# EAGLE design RF test board (EAGLE 7.3.0)
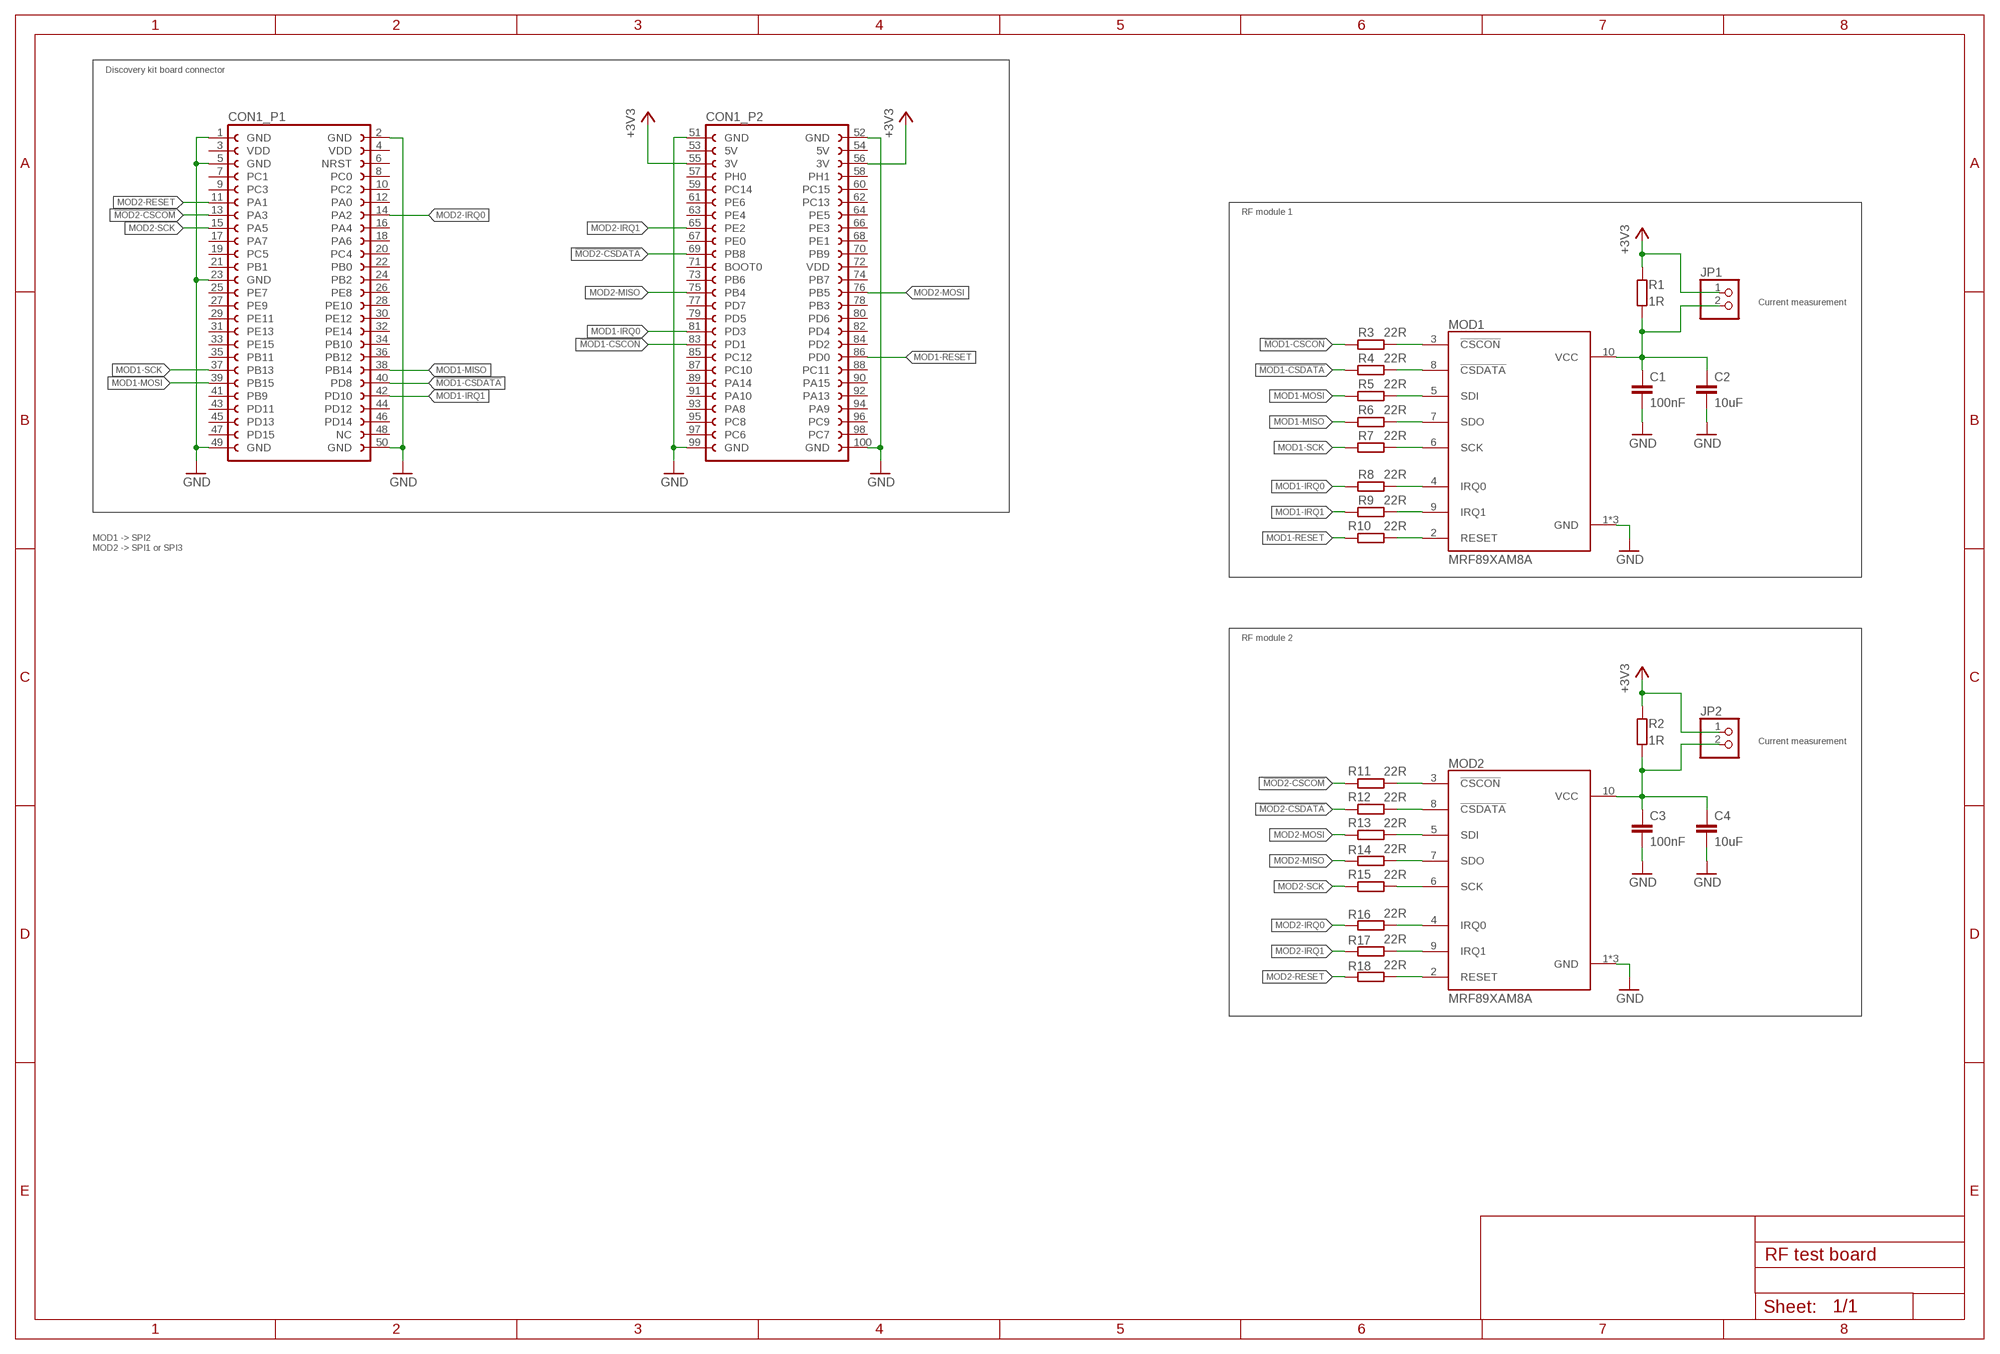
[diagram p0: schematic, sheet 1]

## Parts
C1  100nF  C-EUC0603K  [C0603K]
C2  10uF  C-EUC1206K  [C1206K]
C3  100nF  C-EUC0603K  [C0603K]
C4  10uF  C-EUC1206K  [C1206K]
CON1  STM32F4DISCOVERY-CONNECTOR  [STM32F4DISCOVERY_CONNECTOR]
JP1  PINHD-1X2  [1X02]
JP2  PINHD-1X2  [1X02]
MOD1  MRF89XAM8A  [MRF89XAM8A]
MOD2  MRF89XAM8A  [MRF89XAM8A]
R1  1R  R-EU_R0603  [R0603]
R2  1R  R-EU_R0603  [R0603]
R3  22R  R-EU_R0603  [R0603]
R4  22R  R-EU_R0603  [R0603]
R5  22R  R-EU_R0603  [R0603]
R6  22R  R-EU_R0603  [R0603]
R7  22R  R-EU_R0603  [R0603]
R8  22R  R-EU_R0603  [R0603]
R9  22R  R-EU_R0603  [R0603]
R10  22R  R-EU_R0603  [R0603]
R11  22R  R-EU_R0603  [R0603]
R12  22R  R-EU_R0603  [R0603]
R13  22R  R-EU_R0603  [R0603]
R14  22R  R-EU_R0603  [R0603]
R15  22R  R-EU_R0603  [R0603]
R16  22R  R-EU_R0603  [R0603]
R17  22R  R-EU_R0603  [R0603]
R18  22R  R-EU_R0603  [R0603]

## Nets
!MOD1-CSCON: CON1.83(_P2:PD1) R3.2
!MOD1-CSDATA: CON1.40(_P1:PD8) R4.2
!MOD2-CSCOM: CON1.13(_P1:PA3) R11.2
!MOD2-CSDATA: CON1.69(_P2:PB8) R12.2
+3V3: CON1.55(_P2:3V) CON1.56(_P2:3V) JP1.1 JP2.1 R1.2 R2.2
GND: C1.2 C2.2 C3.2 C4.2 CON1.1(_P1:GND) CON1.2(_P1:GND) CON1.5(_P1:GND) CON1.23(_P1:GND) CON1.49(_P1:GND) CON1.50(_P1:GND) CON1.51(_P2:GND) CON1.52(_P2:GND) CON1.99(_P2:GND) CON1.100(_P2:GND) MOD1.1(GND) MOD1.11(GND) MOD1.12(GND) MOD2.1(GND) MOD2.11(GND) MOD2.12(GND)
MOD1-IRQ0: CON1.81(_P2:PD3) R8.2
MOD1-IRQ1: CON1.42(_P1:PD10) R9.2
MOD1-MISO: CON1.38(_P1:PB14) R6.2
MOD1-MOSI: CON1.39(_P1:PB15) R5.2
MOD1-RESET: CON1.86(_P2:PD0) R10.2
MOD1-SCK: CON1.37(_P1:PB13) R7.2
MOD2-IRQ0: CON1.14(_P1:PA2) R16.2
MOD2-IRQ1: CON1.65(_P2:PE2) R17.2
MOD2-MISO: CON1.75(_P2:PB4) R14.2
MOD2-MOSI: CON1.76(_P2:PB5) R13.2
MOD2-RESET: CON1.11(_P1:PA1) R18.2
MOD2-SCK: CON1.15(_P1:PA5) R15.2
N$1: C1.1 C2.1 JP1.2 MOD1.10(VCC) R1.1
N$2: C3.1 C4.1 JP2.2 MOD2.10(VCC) R2.1
N$3: MOD1.3(!CSCON) R3.1
N$4: MOD1.8(!CSDATA) R4.1
N$5: MOD1.5(SDI) R5.1
N$6: MOD1.7(SDO) R6.1
N$7: MOD1.6(SCK) R7.1
N$8: MOD1.4(IRQ0) R8.1
N$9: MOD1.9(IRQ1) R9.1
N$10: MOD1.2(RESET) R10.1
N$11: MOD2.3(!CSCON) R11.1
N$12: MOD2.8(!CSDATA) R12.1
N$13: MOD2.5(SDI) R13.1
N$14: MOD2.7(SDO) R14.1
N$15: MOD2.6(SCK) R15.1
N$16: MOD2.4(IRQ0) R16.1
N$17: MOD2.9(IRQ1) R17.1
N$18: MOD2.2(RESET) R18.1
Unconnected: CON1.3(_P1:VDD) CON1.4(_P1:VDD) CON1.6(_P1:NRST) CON1.7(_P1:PC1) CON1.8(_P1:PC0) CON1.9(_P1:PC3) CON1.10(_P1:PC2) CON1.12(_P1:PA0) CON1.16(_P1:PA4) CON1.17(_P1:PA7) CON1.18(_P1:PA6) CON1.19(_P1:PC5) CON1.20(_P1:PC4) CON1.21(_P1:PB1) CON1.22(_P1:PB0) CON1.24(_P1:PB2) CON1.25(_P1:PE7) CON1.26(_P1:PE8) CON1.27(_P1:PE9) CON1.28(_P1:PE10) CON1.29(_P1:PE11) CON1.30(_P1:PE12) CON1.31(_P1:PE13) CON1.32(_P1:PE14) CON1.33(_P1:PE15) CON1.34(_P1:PB10) CON1.35(_P1:PB11) CON1.36(_P1:PB12) CON1.41(_P1:PB9) CON1.43(_P1:PD11) CON1.44(_P1:PD12) CON1.45(_P1:PD13) CON1.46(_P1:PD14) CON1.47(_P1:PD15) CON1.48(_P1:NC) CON1.53(_P2:5V) CON1.54(_P2:5V) CON1.57(_P2:PH0) CON1.58(_P2:PH1) CON1.59(_P2:PC14) CON1.60(_P2:PC15) CON1.61(_P2:PE6) CON1.62(_P2:PC13) CON1.63(_P2:PE4) CON1.64(_P2:PE5) CON1.66(_P2:PE3) CON1.67(_P2:PE0) CON1.68(_P2:PE1) CON1.70(_P2:PB9) CON1.71(_P2:BOOT0) CON1.72(_P2:VDD) CON1.73(_P2:PB6) CON1.74(_P2:PB7) CON1.77(_P2:PD7) CON1.78(_P2:PB3) CON1.79(_P2:PD5) CON1.80(_P2:PD6) CON1.82(_P2:PD4) CON1.84(_P2:PD2) CON1.85(_P2:PC12) CON1.87(_P2:PC10) CON1.88(_P2:PC11) CON1.89(_P2:PA14) CON1.90(_P2:PA15) CON1.91(_P2:PA10) CON1.92(_P2:PA13) CON1.93(_P2:PA8) CON1.94(_P2:PA9) CON1.95(_P2:PC8) CON1.96(_P2:PC9) CON1.97(_P2:PC6) CON1.98(_P2:PC7)

## Notes on the sheet
- Discovery kit board connector
- RF module 1
- Current measurement
- MOD1 -> SPI2
  MOD2 -> SPI1 or SPI3
- RF module 2
- Current measurement

## Library data of the parts
C1-C4 = rcl:C-EU: CAPACITOR, European symbol
CON1 = stm32f4Discovery_connector:STM32F4DISCOVERY-CONNECTOR
JP1 JP2 = pinhead:PINHD-1X2: PIN HEADER
MOD1 MOD2 = MRF89XAM8A:MRF89XAM8A
R1-R18 = rcl:R-EU_: RESISTOR, European symbol

## Board
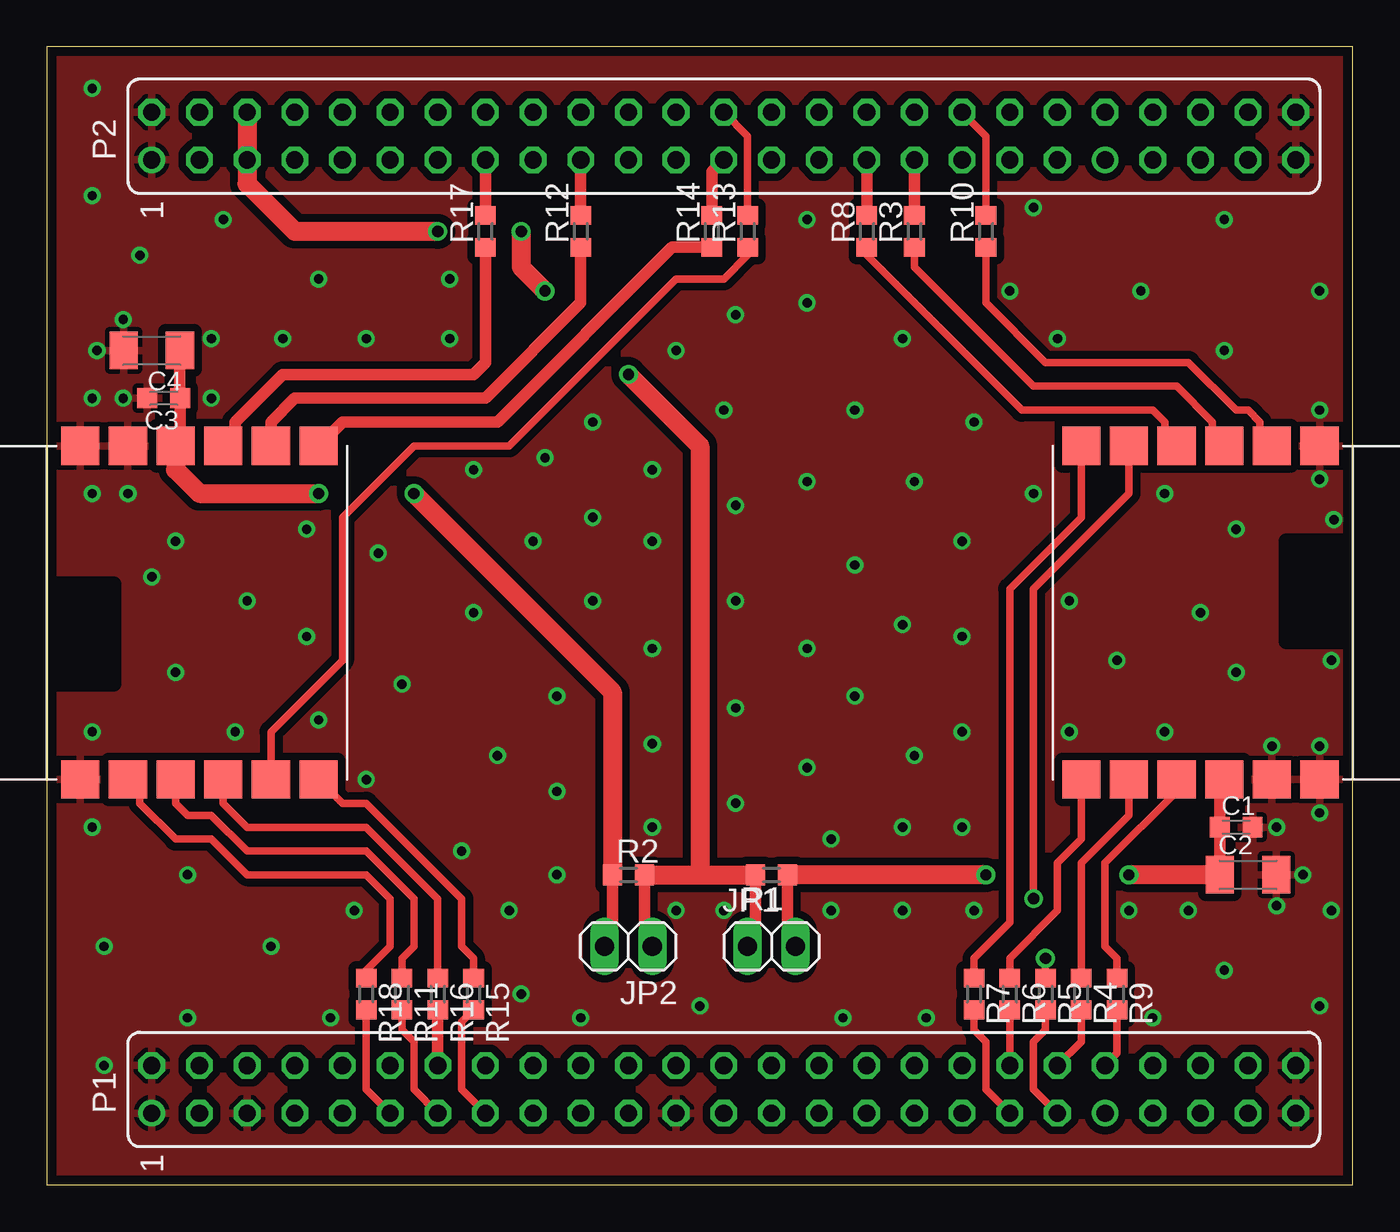
[diagram p1: board, top side]
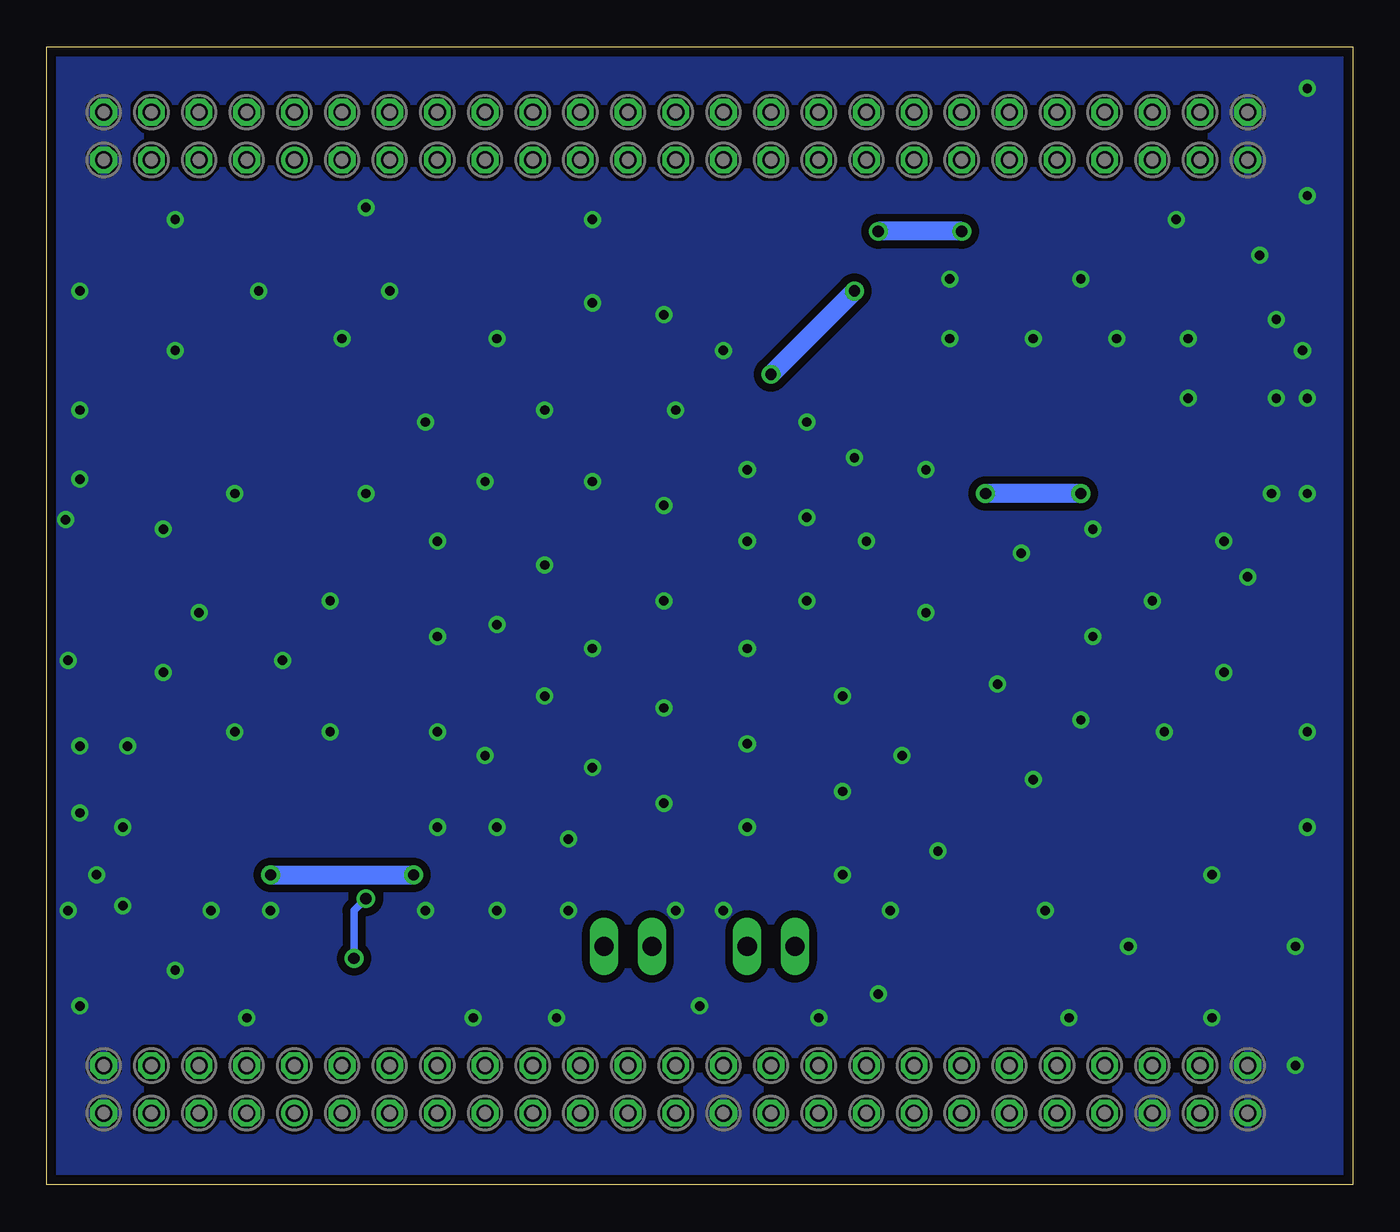
[diagram p2: board, bottom side, seen from below]

Size 69.58 x 60.63 mm. Coordinates in mm from the lower left corner, seen from the top.
Outline: 0,0 69.58,0 69.58,60.63 0,60.63 0,0
Copper layers (1*16): Top 0.035mm / dielectric 1.5mm / Bottom 0.035mm
Design rules "default *": minimum track width 10mil, minimum drill 15mil, track to track 8mil, track to pad 8mil, pad to pad 8mil, via to via 8mil, smd to smd 8mil, copper to edge 20mil, drill to drill 8mil, minimum pad ring 10mil, minimum via ring 8mil, stop-mask expansion 4mil, vias tented up to drill 0mil, thermal gap 10mil

### Footprints (pad centres in the part's own frame; a part is rotated, then mirrored left to right if it is on the bottom)
C0603K = smd 1.05 x 1.08: 1 -0.875,0; 2 0.875,0
C1206K = smd 1.5 x 2: 1 -1.5,0; 2 1.5,0
STM32F4DISCOVERY_CONNECTOR = drill 0.914: 1 -1.27,30.48; 41 -1.27,-20.32; 51 49.53,30.48; 91 49.53,-20.32 | drill 0.914 octagon: 2 1.27,30.48; 3 -1.27,27.94; 4 1.27,27.94; 5 -1.27,25.4; 6 1.27,25.4; 7 -1.27,22.86; 8 1.27,22.86; 9 -1.27,20.32; 10 1.27,20.32; 11 -1.27,17.78; 12 1.27,17.78; 13 -1.27,15.24; 14 1.27,15.24; 15 -1.27,12.7; 16 1.27,12.7; 17 -1.27,10.16; 18 1.27,10.16; 19 -1.27,7.62; 20 1.27,7.62; 21 -1.27,5.08; 22 1.27,5.08; 23 -1.27,2.54; 24 1.27,2.54; 25 -1.27,0; 26 1.27,0; 27 -1.27,-2.54; 28 1.27,-2.54; 29 -1.27,-5.08; 30 1.27,-5.08; 31 -1.27,-7.62; 32 1.27,-7.62; 33 -1.27,-10.16; 34 1.27,-10.16; 35 -1.27,-12.7; 36 1.27,-12.7; 37 -1.27,-15.24; 38 1.27,-15.24; 39 -1.27,-17.78; 40 1.27,-17.78; 42 1.27,-20.32; 43 -1.27,-22.86; 44 1.27,-22.86; 45 -1.27,-25.4; 46 1.27,-25.4; 47 -1.27,-27.94; 48 1.27,-27.94; 49 -1.27,-30.48; 50 1.27,-30.48; 52 52.07,30.48; 53 49.53,27.94; 54 52.07,27.94; 55 49.53,25.4; 56 52.07,25.4; 57 49.53,22.86; 58 52.07,22.86; 59 49.53,20.32; 60 52.07,20.32; 61 49.53,17.78; 62 52.07,17.78; 63 49.53,15.24; 64 52.07,15.24; 65 49.53,12.7; 66 52.07,12.7; 67 49.53,10.16; 68 52.07,10.16; 69 49.53,7.62; 70 52.07,7.62; 71 49.53,5.08; 72 52.07,5.08; 73 49.53,2.54; 74 52.07,2.54; 75 49.53,0; 76 52.07,0; 77 49.53,-2.54; 78 52.07,-2.54; 79 49.53,-5.08; 80 52.07,-5.08; 81 49.53,-7.62; 82 52.07,-7.62; 83 49.53,-10.16; 84 52.07,-10.16; 85 49.53,-12.7; 86 52.07,-12.7; 87 49.53,-15.24; 88 52.07,-15.24; 89 49.53,-17.78; 90 52.07,-17.78; 92 52.07,-20.32; 93 49.53,-22.86; 94 52.07,-22.86; 95 49.53,-25.4; 96 52.07,-25.4; 97 49.53,-27.94; 98 52.07,-27.94; 99 49.53,-30.48; 100 52.07,-30.48
1X02 = drill 1.016 long: 1 -1.27,0; 2 1.27,0
MRF89XAM8A = smd 2.032 x 2.032: 1 -8.89,6.35; 2 -8.89,3.81; 3 -8.89,1.27; 4 -8.89,-1.27; 5 -8.89,-3.81; 6 -8.89,-6.35; 7 8.89,-6.35; 8 8.89,-3.81; 9 8.89,-1.27; 10 8.89,1.27; 11 8.89,3.81; 12 8.89,6.35
R0603 = smd 1 x 1.1: 1 -0.85,0; 2 0.85,0

### Placement (x,y rotation side)
C1  63.37,19.05 0 top
C2  64.01,16.51 0 top
C3  6.22,41.91 180 top
C4  5.59,44.45 180 top
CON1  36.07,5.08 90 top
JP1  38.61,12.7 0 top
JP2  30.99,12.7 180 top
MOD1  61.47,30.48 270 top
MOD2  8.13,30.48 90 top
R1  38.61,16.51 180 top
R2  30.99,16.51 0 top
R3  46.23,50.8 90 top
R4  55.12,10.16 270 top
R5  53.21,10.16 270 top
R6  51.31,10.16 270 top
R7  49.4,10.16 270 top
R8  43.69,50.8 90 top
R9  57.02,10.16 270 top
R10  50.04,50.8 90 top
R11  18.92,10.16 270 top
R12  28.45,50.8 90 top
R13  37.34,50.8 90 top
R14  35.43,50.8 90 top
R15  22.73,10.16 270 top
R16  20.83,10.16 270 top
R17  23.37,50.8 90 top
R18  17.02,10.16 270 top

### Tracks (layer width: path | path; a pad name or v marks a point on that pad's centre or on a via)
!MOD1-CSCON
  Top 0.61: CON1.83 R3.2
!MOD1-CSDATA
  Top 0.406: R4.2 55.12,7.62 CON1.40
!MOD2-CSCOM
  Top 0.406: R11.2 18.92,8.26 19.56,7.62 19.56,5.08 CON1.13
!MOD2-CSDATA
  Top 0.61: R12.2 CON1.69
+3V3  (via drill 0.6)
  Top 0.61: R2.2 31.84,12.7 JP2.1 | R1.2 37.76,12.7 JP1.1
  Top 1.016: R2.2 34.8,16.51 | 34.8,16.51 R1.2 | CON1.56 CON1.55 10.67,53.34 13.21,50.8 v20.83,50.8 | v25.27,50.8 25.27,48.9 v26.54,47.62 | v30.99,43.18 34.8,39.37 34.8,16.51
  Bottom 1.016: v20.83,50.8 v25.27,50.8 | v26.54,47.62 v30.99,43.18
GND  (via drill 0.5)
  other vias: 2.41,58.42 2.67,44.45 2.41,52.7 9.4,51.44 4.95,49.53 17.65,33.66 14.48,24.77 17.02,21.59 22.1,17.78 25.27,10.16 24.64,14.61 22.73,30.48 27.18,26.04 27.18,16.51 18.92,26.67 24,22.86 27.18,20.95 33.53,14.61 36.07,14.61 34.8,9.53 28.45,8.89 42.42,8.89 49.4,14.61 41.78,14.61 46.86,8.89 45.59,14.61 22.73,38.1 25.91,34.29 29.08,31.11 32.26,19.05 32.26,23.5 32.26,28.57 32.26,34.29 32.26,38.1 29.08,40.64 26.54,38.73 29.08,35.56 33.53,44.45 36.07,41.27 36.7,36.2 36.7,31.11 36.7,25.4 36.7,20.32 41.78,18.41 48.77,19.05 45.59,19.05 48.77,24.13 48.77,29.21 48.77,34.29 52.58,36.83 49.4,40.64 45.59,45.09 40.51,51.44 40.51,46.99 36.7,46.35 43.05,41.27 43.05,33.02 43.05,26.04 40.51,37.47 40.51,28.57 40.51,22.23 46.23,22.86 45.59,29.84 46.23,37.47 59.56,36.83 63.37,34.92 67.82,37.59 68.58,35.43 54.48,31.11 54.48,24.13 57.02,27.94 59.56,24.13 61.47,30.48 63.37,27.3 65.28,23.37 67.82,23.37 68.45,27.94 67.82,19.81 65.53,19.05 66.93,16.51 68.45,14.61 60.83,14.61 65.53,14.86 62.74,11.43 58.93,8.89 67.82,9.53 57.66,14.61 3.05,6.35 3.05,12.7 2.41,19.05 7.49,8.89 11.94,12.7 15.11,8.89 16.38,14.61 7.49,16.51 2.41,24.13 6.86,27.3 10.03,24.13 13.84,29.21 10.67,31.11 5.59,32.38 6.86,34.29 4.32,36.83 2.41,36.83 13.84,34.92 2.41,41.91 4.06,41.91 8.76,41.91 8.76,45.09 4.06,46.1 12.57,45.09 17.02,45.09 21.46,45.09 21.46,48.26 14.48,48.26 62.74,51.44 67.82,47.62 67.82,41.27 62.74,44.45 58.29,47.62 53.85,45.09 51.31,47.62 52.58,52.07
  pour Top (isolate 0.406): 0.51,0 69.09,0 69.09,60.96 0.51,60.96
  pour Bottom (isolate 0.406): -0.76,0 70.36,0 70.36,60.96 -0.76,60.96
MOD1-IRQ0
  Top 0.61: CON1.81 R8.2
MOD1-IRQ1
  Top 0.406: R9.2 57.02,6.99 CON1.42
MOD1-MISO
  Top 0.406: CON1.38 R6.2
MOD1-MOSI
  Top 0.406: CON1.39 52.58,5.08 52.58,7.62 53.21,8.26 R5.2
MOD1-RESET
  Top 0.406: R10.2 50.04,55.88 CON1.86
MOD1-SCK
  Top 0.406: CON1.37 50.04,5.08 50.04,7.62 49.4,8.26 R7.2
MOD2-IRQ0
  Top 0.61: R16.2 CON1.14
MOD2-IRQ1
  Top 0.61: R17.2 CON1.65
MOD2-MISO
  Top 0.61: CON1.75 35.43,53.98 R14.2
MOD2-MOSI
  Top 0.406: R13.2 37.34,55.88 CON1.76
MOD2-RESET
  Top 0.406: R18.2 17.02,5.08 CON1.11
MOD2-SCK
  Top 0.406: R15.2 22.1,8.68 22.1,5.08 CON1.15
N$1  (via drill 0.6)
  Top 0.61: MOD1.10 62.5,21.35 C1.1 C2.1 | R1.1 39.46,12.7 JP1.2
  Top 1.016: C2.1 v57.66,16.51 | v50.04,16.51 R1.1
  Bottom 1.016: v57.66,16.51 v50.04,16.51
N$2  (via drill 0.6)
  Top 0.61: MOD2.10 7.1,39.61 C3.1 C4.1 | R2.1 30.14,12.7 JP2.2
  Top 1.016: MOD2.10 6.86,38.1 8.13,36.83 v14.48,36.83 | v19.56,36.83 30.14,26.25 R2.1
  Bottom 1.016: v14.48,36.83 v19.56,36.83
N$3
  Top 0.406: MOD1.3 62.1,40.01 62.1,40.64 60.2,42.55 52.58,42.55 46.23,48.9 R3.1
N$4
  Top 0.406: R4.1 55.12,17.14 57.66,19.68 MOD1.8
N$5  (via drill 0.6)
  Top 0.4: v53.21,12.06 R5.1
  Top 0.406: MOD1.5 57.66,36.83 52.58,31.75 v52.58,15.24
  Bottom 0.4: v52.58,15.24 53.21,14.61 v53.21,12.06
N$6
  Top 0.406: MOD1.7 55.12,18.41 53.85,17.14 53.85,14.61 51.31,12.06 R6.1
N$7
  Top 0.4: MOD1.6 55.12,35.56 51.31,31.75 51.31,13.97 49.4,12.06 R7.1
N$8
  Top 0.406: MOD1.4 59.56,40.01 59.56,40.64 58.93,41.27 51.94,41.27 43.69,49.53 R8.1
N$9
  Top 0.406: R9.1 57.02,12.06 56.39,12.7 56.39,17.14 60.2,20.95 MOD1.9
N$10
  Top 0.406: MOD1.2 64.64,40.01 64.64,40.64 64.01,41.27 63.37,41.27 60.83,43.81 53.21,43.81 50.04,46.99 R10.1
N$11
  Top 0.406: MOD2.3 6.86,20.32 7.49,19.68 8.76,19.68 10.67,17.78 17.02,17.78 19.56,15.24 19.56,12.7 18.92,12.06 R11.1
N$12
  Top 0.61: MOD2.8 11.94,40.64 13.21,41.91 23.37,41.91 28.45,46.99 R12.1
N$13
  Top 0.406: R13.1 37.34,49.53 36.07,48.26 33.53,48.26 24.64,39.37 19.56,39.37 15.75,35.56 15.75,27.94 11.94,24.13 MOD2.5
N$14
  Top 0.61: R14.1 33.31,49.95 24,40.64 15.75,40.64 MOD2.7
N$15
  Top 0.406: MOD2.6 15.75,20.32 17.02,20.32 22.1,15.24 22.1,12.7 22.73,12.06 R15.1
N$16
  Top 0.406: MOD2.4 9.4,20.32 10.67,19.05 17.02,19.05 20.83,15.24 R16.1
N$17
  Top 0.61: MOD2.9 10.03,40.01 10.03,40.64 12.57,43.18 22.73,43.18 23.37,43.81 R17.1
N$18
  Top 0.406: MOD2.2 4.95,20.95 4.95,20.32 6.86,18.41 8.76,18.41 10.67,16.51 17.02,16.51 18.29,15.24 18.29,12.7 17.02,11.43 R18.1